# Altium project Đề21.PrjPcb
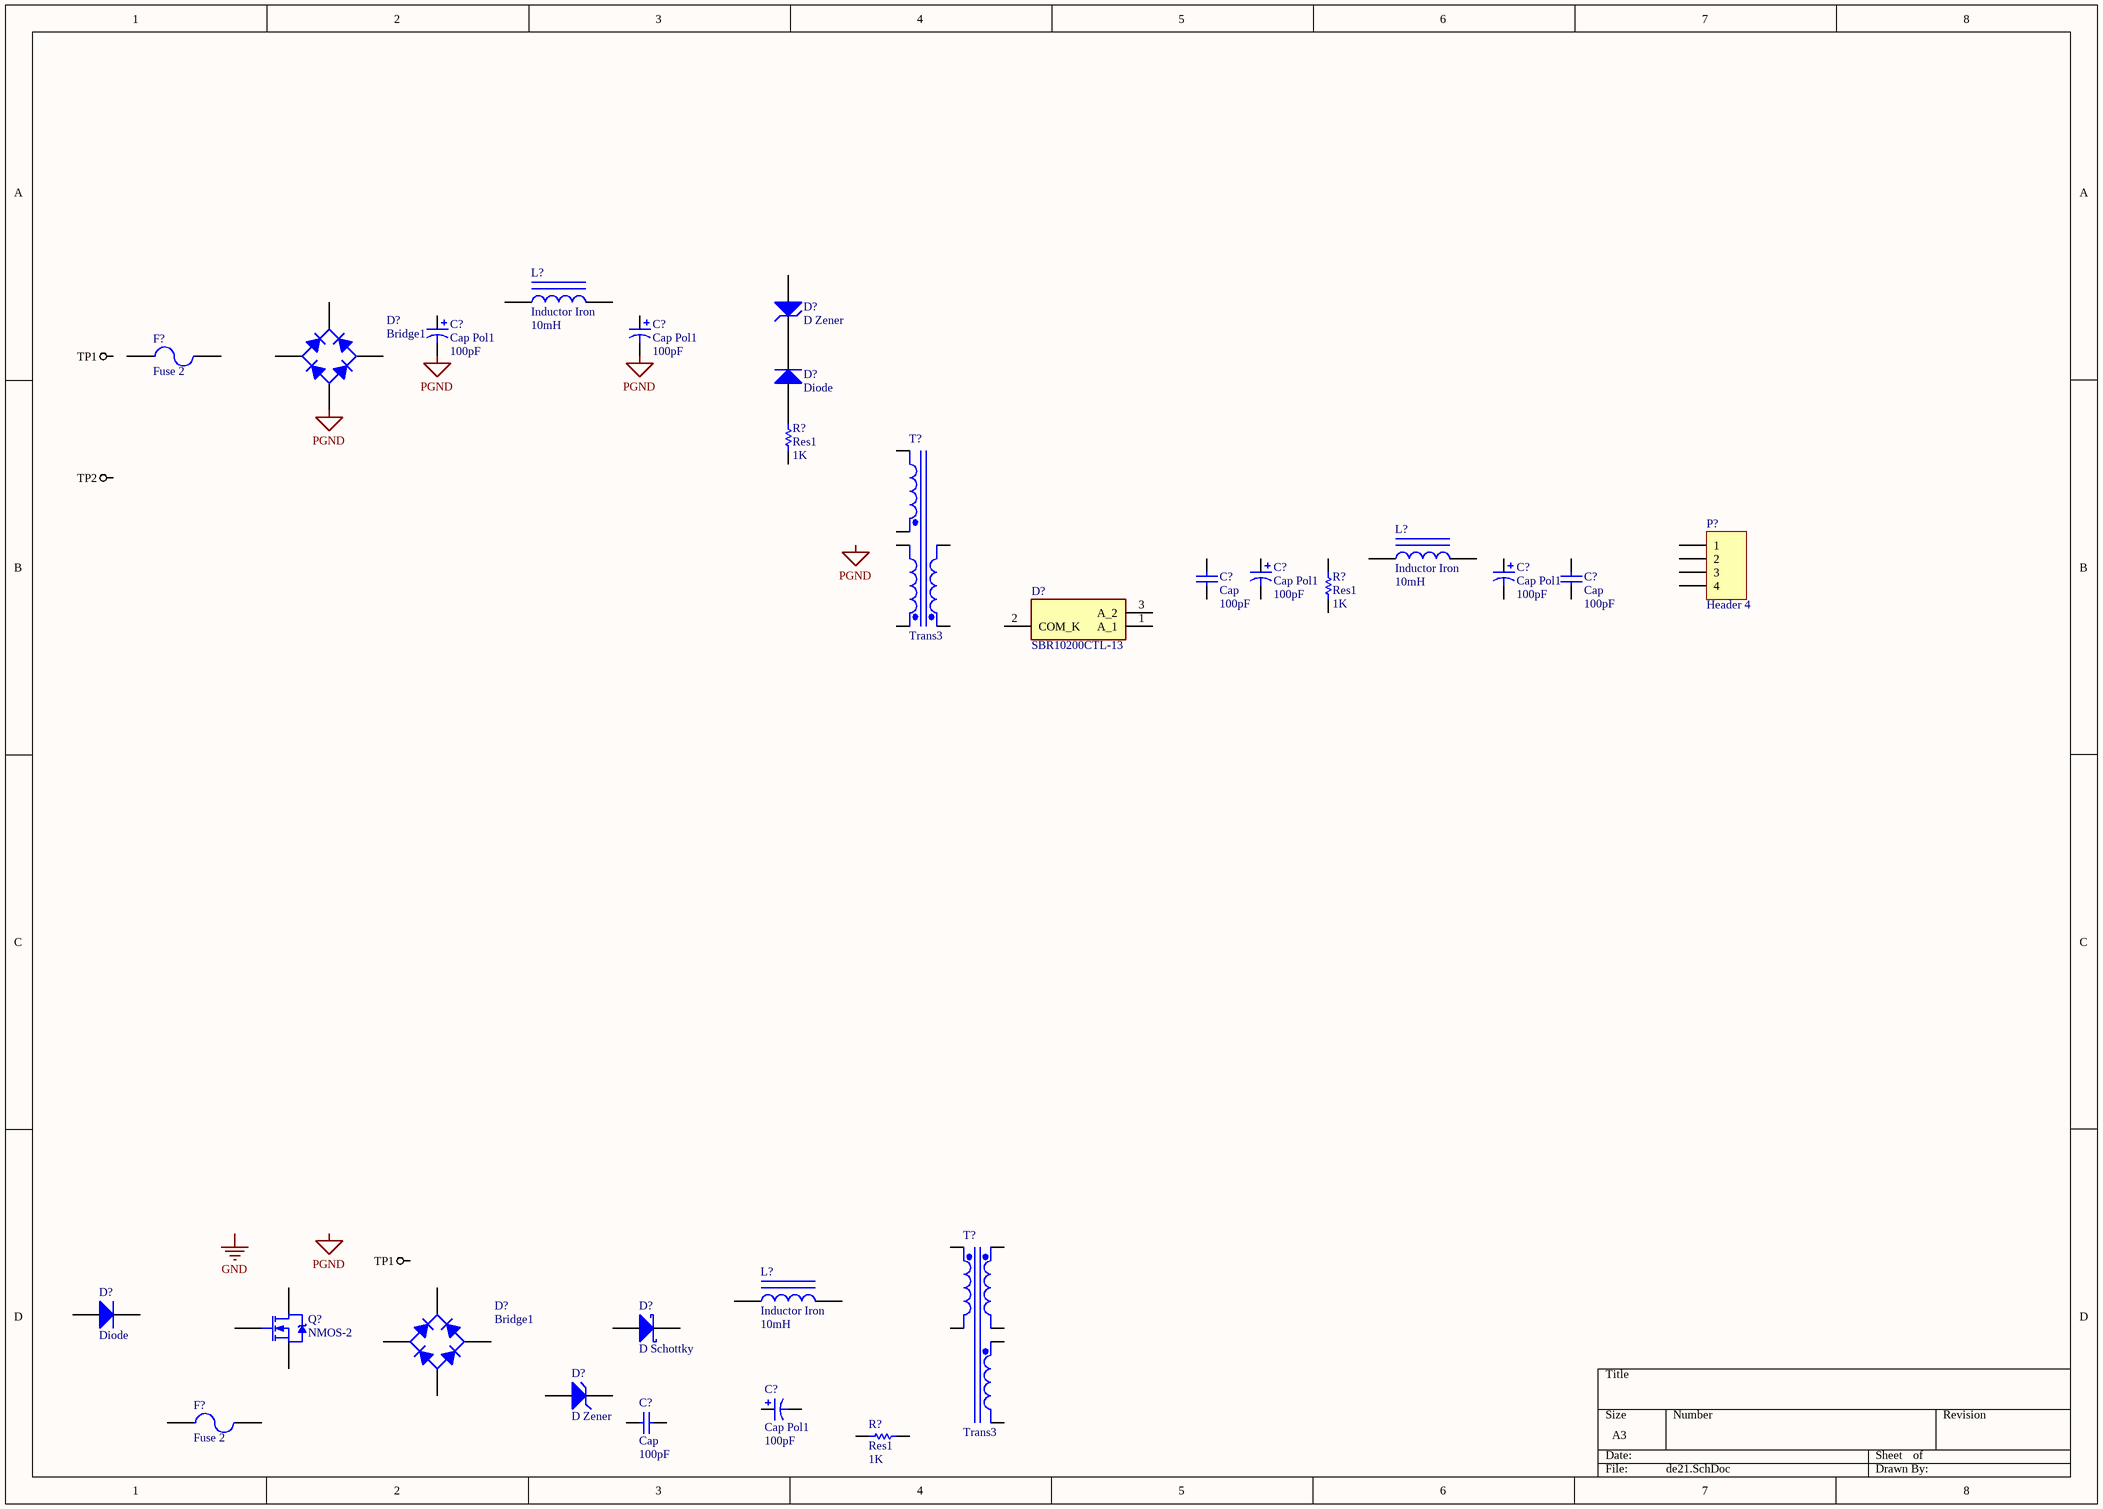
[diagram p0: de21.SchDoc]
1 sheet, 28 parts. Net scope: global (net labels, ports and power ports of the same name join across sheets).

## Sheet de21.SchDoc
size A3; SheetNumber: 1; SheetTotal: 1; SPICEModelCacheZIHIERPO: <root> / <DocumentId>ZIHIERPO</DocumentId> / <CacheFrame Number="0"> / <Model Name="fuse" Kind="CKT"> / <Text>.SUBCKT FUSE 1 2 PARAMS: CURRENT=1 RESISTANCE=1m / SW1 1 2 3 0 SMOD OFF / BNLV 3 0 V=(abs(v(1,2))) / .MODEL SMOD SW (VT={(CURRENT*RESISTANCE)} RON=1g ROFF={RESISTANCE}) / .ENDS FUSE</Text> / </Model> / <Model Name="bridge" Kind="CKT"> / <Text>*Default Diode Bridge Rectifier / *Connections: / *              V- / *              | AC1 / *              | | V+ / *              | | | AC2 / *              | | | | / .SUBCKT BRIDGE 1 2 3 4 / D1 1 2 DMOD / D2 1 4 DMOD / D3 2 3 DMOD / D4 4 3 DMOD / .MODEL DMOD D () / .ENDS BRIDGE</Text> / </Model> / <Model Name="ni3wtrans" Kind="CKT"> / <Text>*Non-ideal 4-winding Transformer / *jjt created 18/1/2001. / *jjt 18/1/2002: changed LX2D,LX3D comments to match subcircuit parameters (X2D, X3D) to avoid possible confusion. / *Connections: / *                 Pri+ / *                 |   Pri- / *                 |   |   Sec1+ / *                 |   |   |   Sec1- / *                 |   |   |   |   Sec2+ / *                 |   |   |   |   |   Sec2- / *                 |   |   |   |   |   | / *                 |   |   |   |   |   | / *                 |   |   |   |   |   | / *                 |   |   |   |   |   | / .SUBCKT NI3WTRANS 1   2   3   4   5   6      PARAMS: RATIO1=1 RATIO2=1 RPRI=0.1 R2D=0.1 R3D=0.1 L1=1U / + X2D=1u X3D=1u XM=1k RCORE=1Meg / VISRC1   4 11 0V / VISRC2   6 14 0V / FCTRL1   10 2 VISRC1 {RATIO1} / FCTRL2   13 2 VISRC2 {RATIO2} / EVCVS1   3 11 10 2 {RATIO1} / EVCVS2   5 14 13 2 {RATIO2} / RRPRI    1 8 {RPRI} / RR2D    9 10 {R2D} / RR3D    12 13 {R3D} / LL1   8 7 {L1} / LX2D  7 9 {X2D} / LX3D  7 12 {X3D} / LXM   7 2 {XM} / RRCORE 7 2 {RCORE} / .ENDS NI3WTRANS</Text> / </Model> / <Model Name="irf1010" Kind="CKT"> / <Text>*IRF1010 MCE 4-2-96 / *55V  75A .014 ohm HEXFET pkg:TO-220 2,1,3 / .SUBCKT IRF1010  10 20 40 40 / M1   1  2  3  3  DMOS L=1U W=1U / RD  10  1  5.65M / RS  30  3  1.35M / RG  20  2  12.1 / CGS  2  3  2.15N / EGD 12  0  2  1  1 / VFB 14  0  0 / FFB  2  1  VFB  1 / CGD 13 14  4.49N / R1  13  0  1 / D1  12 13  DLIM / DDG 15 14  DCGD / R2  12 15  1 / D2  15  0  DLIM / DSD  3 10  DSUB / LS  30 40  7.5N / .MODEL DMOS NMOS (LEVEL=3 THETA=60M VMAX=114K ETA=2M VTO=3 KP=19.4) / .MODEL DCGD D (CJO=4.49N VJ=.6 M=.68) / .MODEL DSUB D (IS=311N N=1.5 RS=8.67M BV=55 CJO=4.08N VJ=.8 M=.42 TT=100N) / .MODEL DLIM D (IS=100U) / .ENDS IRF1010</Text> / </Model> / <Model Name="skydiode" Kind="MDL"> / <Text>*Default Schottky Diode / *Schottky Diode Pinout: A,K / .MODEL SKYDIODE D(EG=0.69 XTI=2)</Text> / </Model> / <Model Name="zener" Kind="MDL"> / <Text>*ZENER / *Default Zener 10V @ 10mA / *Zener Diode Pinout: A,K / .MODEL ZENER D( BV=10 IBV=10E-3 )</Text> / </Model> / <Model Name="diode" Kind="MDL"> / <Text>*Default Diode / *Diode Pinout: A,K / .MODEL DIODE D()</Text> / </Model> / </CacheFrame> / </root>

### Parts
(Parts that share a designator on the sheet are numbered #1, #2 ... from top to bottom, then left to right.)
C?#1  Cap Pol1  value 100pF  [RB7.6-15]
C?#2  Cap Pol1  value 100pF  [RB7.6-15]
C?#3  Cap Pol1  value 100pF  [RB7.6-15]
C?#4  Cap Pol1  value 100pF  [RB7.6-15]
C?#5  Cap  value 100pF  [RAD-0.3]
C?#6  Cap  value 100pF  [RAD-0.3]
C?#7  Cap Pol1  value 100pF  [RB7.6-15]
C?#8  Cap  value 100pF  [RAD-0.3]
D?#1  D Zener  [DIODE-0.7]
D?#2  Bridge1  [D-38]
D?#3  Diode  [SMC]
D?#4  SBR10200CTL-13  [SBR10200CTL13]
D?#5  Diode  [SMC]
D?#6  D Schottky  [SMB]
D?#7  Bridge1  [D-38]
D?#8  D Zener  [DIODE-0.7]
F?#1  Fuse 2  [PIN-W2/E2.8]
F?#2  Fuse 2  [PIN-W2/E2.8]
L?#1  Inductor Iron  value 10mH  [AXIAL-0.9]
L?#2  Inductor Iron  value 10mH  [AXIAL-0.9]
L?#3  Inductor Iron  value 10mH  [AXIAL-0.9]
P?  Header 4  [HDR1X4]
Q?  NMOS-2  [TO-220AB]
R?#1  Res1  value 1K  [AXIAL-0.3]
R?#2  Res1  value 1K  [AXIAL-0.3]
R?#3  Res1  value 1K  [AXIAL-0.3]
T?#1  Trans3  [TRF_6]
T?#2  Trans3  [TRF_6]

### Nets
PGND: C?#1.2 C?#2.2 D?#2.3(A)
NetD?#1_2: D?#1.2(K) D?#3.2(K)
NetD?#3_1: D?#3.1(A) R?#1.2

Not connected (* = marked no-connect by the designer): C?#1 1; C?#2 1; C?#3 1 2; C?#4 1 2; C?#5 1 2; C?#6 1 2; C?#7 1 2; C?#8 1 2; D?#1 1(A); D?#2 1(K) 2(C) 4(C); D?#4 1(A_1) 2(COM_K) 3(A_2); D?#5 1(A) 2(K); D?#6 1(A) 2(K); D?#7 1(K) 2(C) 3(A) 4(C); D?#8 1(A) 2(K); F?#1 1 2; F?#2 1 2; L?#1 1 2; L?#2 1 2; L?#3 1 2; P? 1 2 3 4; Q? 1(G) 2(D) 3(S); R?#1 1; R?#2 1 2; R?#3 1 2; T?#1 1(Pri+) 2(Pri-) 3(Sec1+) 4(Sec1-) 5(Sec2+) 6(Sec2-); T?#2 1(Pri+) 2(Pri-) 3(Sec1+) 4(Sec1-) 5(Sec2+) 6(Sec2-)

### Notes on the sheet
- Labels drawn without touching a wire or pin: GND, PGND, TP1, TP2

### Library data of the parts
C?#1-C?#4 C?#7 = Cap Pol1: Polarized Capacitor (Radial); Published: 8-Jun-2000; LatestRevisionDate: 17-Jul-2002; LatestRevisionNote: Re-released for DXP Platform.; PackageReference: RB7.6-15; Publisher: Altium Limited; PackageDescription: Polarized Capacitor (Radial); 2 Leads
C?#5 C?#6 C?#8 = Cap: Capacitor; Published: 8-Jun-2000; LatestRevisionDate: 17-Jul-2002; LatestRevisionNote: Re-released for DXP Platform.; PackageReference: RAD-0.3; Publisher: Altium Limited; PackageDescription: Radial Cap, Thru-Hole; 2 Leads; 0.3 in Pin Spacing
D?#1 D?#8 = D Zener: Zener Diode; Published: 8-Jun-2000; LatestRevisionDate: 17-Jul-2002; LatestRevisionNote: Re-released for DXP Platform.; PackageReference: DIODE-0.7; Publisher: Altium Limited; PackageDescription: Diode, Thru-Hole; 2 Leads; 0.7 in Pin Spacing
D?#2 D?#7 = Bridge1: Full Wave Diode Bridge; Published: 8-Jun-2000; LatestRevisionDate: 29-May-2009; LatestRevisionNote: Sch pins A & K swapped.; DatasheetVersion: E2732B; PackageReference: D-38; Publisher: Altium Limited; PackageDescription: Bridge Rectifier; 4 Terminals; Body 9.4 x 9.4 mm (typ); Pitch 5.08 mm
D?#3 D?#5 = Diode: Default Diode; Published: 8-Jun-2000; LatestRevisionDate: 17-Jul-2002; LatestRevisionNote: Re-released for DXP Platform.; PackageVersion: Sep-1996; PackageReference: SMC; Publisher: Altium Limited; PackageDescription: DO-214-AB/SMC; 2 C-Bend Leads; Body 7.9 x 5.9 mm, inc. leads (LxW); Code_JEDEC: DO-214-AB
D?#4 = SBR10200CTL-13: Schottky Diodes & Rectifiers Super Barrier Rectif TO252 T&R 2.5K; Manufacturer_Name: Diodes Incorporated; Geometry.Height: 2.52mm; Manufacturer_Part_Number: SBR10200CTL-13; Mouser Part Number: 621-SBR10200CTL-13; Mouser Price/Stock: https://www.mouser.co.uk/ProductDetail/Diodes-Incorporated/SBR10200CTL-13?qs=aXnpsjvrXd14kGc6%2FFum3Q%3D%3D; Arrow Part Number: SBR10200CTL-13; Arrow Price/Stock: https://www.arrow.com/en/products/sbr10200ctl-13/diodes-incorporated; Datasheet Link: https://www.diodes.com//assets/Datasheets/SBR10200CTL.pdf
D?#6 = D Schottky: Schottky Diode; Published: 8-Jun-2000; LatestRevisionDate: 17-Jul-2002; LatestRevisionNote: Re-released for DXP Platform.; PackageReference: SMB; Publisher: Altium Limited; PackageDescription: DO-214-AA/SMB; 2 C-Bend Leads; Body 5.3 x 3.6 mm, inc. leads (LxW); Code_JEDEC: DO-214-AA
F?#1 F?#2 = Fuse 2: Fuse; Published: 8-Jun-2000; LatestRevisionDate: 17-Jul-2002; LatestRevisionNote: Re-released for DXP Platform.; PackageReference: PIN-W2/E2.8; Publisher: Altium Limited; PackageDescription: Thru-Hole; 2 Leads
L?#1-L?#3 = Inductor Iron: Magnetic-Core Inductor; Published: 24-Mar-1999; LatestRevisionDate: 17-Jul-2002; LatestRevisionNote: Re-released for DXP Platform.; PackageReference: AXIAL-0.9; Publisher: Altium Limited; PackageDescription: Axial Device, Thru-Hole; 2 Leads; 0.9 in Pin Spacing
P? = Header 4: Header, 4-Pin; LatestRevisionDate: 17-Jul-2002; LatestRevisionNote: Re-released for DXP Platform.; Publisher: Altium Limited
Q? = NMOS-2: N-Channel Power MOSFET; Note: Pin 2 is electrically connected to pin 4.; Published: 8-Jun-2000; LatestRevisionDate: 17-Jul-2002; LatestRevisionNote: Re-released for DXP Platform.; DatasheetVersion: PD-9.814; PackageVersion: Feb-1997; PackageReference: TO-220AB; Publisher: Altium Limited; PackageDescription: TO, Thru-Hole, Vertical, Heatsink Mounted; 3 In-Line Leads; Pitch 2.54 mm; ComponentLink1Description: Manufacturer Link; ComponentLink1URL: http://www.irf.com/
R?#1-R?#3 = Res1: Resistor; Published: 8-Jun-2000; LatestRevisionDate: 17-Jul-2002; LatestRevisionNote: Re-released for DXP Platform.; PackageReference: AXIAL-0.3; Publisher: Altium Limited; PackageDescription: Axial Device, Thru-Hole; 2 Leads; 0.3 in Pin Spacing
T?#1 T?#2 = Trans3: Three-winding Transformer (Non-Ideal); Sim Note: Enter the turns ratios, Core loss resistance, Magnetising Reactance, Leakage Reactances and Resistances referred to the primary side into the parameter fields.; Published: 25-Jan-2001; LatestRevisionDate: 17-Jul-2002; LatestRevisionNote: Re-released for DXP Platform.; PackageReference: TRF_6; Publisher: Altium Limited; PackageDescription: Transformer; 6 Leads